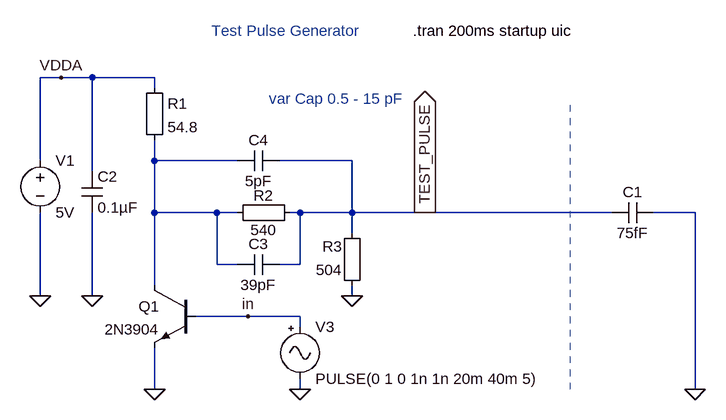
[diagram p0: schematic test_puls_generator.asc]
test_puls_generator.asc, the LTspice schematic file:
Version 4
SHEET 1 880 680
WIRE -144 0 -176 0
WIRE -96 0 -144 0
WIRE 0 0 -96 0
WIRE 0 16 0 0
WIRE -176 128 -176 0
WIRE 0 128 0 96
WIRE 128 128 0 128
WIRE 304 128 192 128
WIRE -96 144 -96 0
WIRE 0 208 0 128
WIRE 96 208 0 208
WIRE 128 208 96 208
WIRE 224 208 208 208
WIRE 304 208 304 128
WIRE 304 208 224 208
WIRE 416 208 304 208
WIRE 704 208 416 208
WIRE 832 208 768 208
WIRE 304 240 304 208
WIRE 96 288 96 208
WIRE 128 288 96 288
WIRE 224 288 224 208
WIRE 224 288 192 288
WIRE 0 320 0 208
WIRE -176 336 -176 208
WIRE -96 336 -96 208
WIRE 304 336 304 320
WIRE 144 368 64 368
WIRE 224 368 144 368
WIRE 224 384 224 368
WIRE 0 480 0 416
WIRE 224 480 224 464
WIRE 832 480 832 208
FLAG -176 336 0
FLAG -96 336 0
FLAG -144 0 VDDA
FLAG 416 208 TEST_PULSE
IOPIN 416 208 Out
FLAG 304 336 0
FLAG 0 480 0
FLAG 224 480 0
FLAG 144 368 in
FLAG 832 480 0
SYMBOL voltage -176 112 R0
WINDOW 123 0 0 Left 0
WINDOW 39 0 0 Left 0
SYMATTR InstName V1
SYMATTR Value 5V
SYMBOL Misc\\EuropeanResistor -16 0 R0
SYMATTR InstName R1
SYMATTR Value 54.8
SYMBOL Misc\\EuropeanResistor 224 192 R90
WINDOW 0 5 56 VBottom 0
WINDOW 3 27 56 VTop 0
SYMATTR InstName R2
SYMATTR Value 540
SYMBOL Misc\\EuropeanResistor 320 336 R180
WINDOW 0 31 76 Left 0
WINDOW 3 31 40 Left 0
SYMATTR InstName R3
SYMATTR Value 504
SYMBOL Misc\\EuropeanCap -112 144 R0
SYMATTR InstName C2
SYMATTR Value 0.1µF
SYMBOL Misc\\EuropeanCap 192 272 R90
WINDOW 0 0 32 VBottom 0
WINDOW 3 32 32 VTop 0
SYMATTR InstName C3
SYMATTR Value 39pF
SYMBOL Misc\\EuropeanCap 128 144 R270
WINDOW 0 32 32 VTop 0
WINDOW 3 0 32 VBottom 0
SYMATTR InstName C4
SYMATTR Value 5pF
SYMBOL npn 64 320 M0
SYMATTR InstName Q1
SYMATTR Value 2N3904
SYMBOL Misc\\signal 224 368 R0
WINDOW 123 0 0 Left 0
SYMATTR InstName V3
SYMATTR Value PULSE(0 1 0 1n 1n 20m 40m 5)
SYMATTR SpiceLine Rser=10
SYMBOL Misc\\EuropeanCap 768 192 R90
WINDOW 0 0 32 VBottom 0
WINDOW 3 32 32 VTop 0
SYMATTR InstName C1
SYMATTR Value 75fF
TEXT 88 -72 Left 0 ;Test Pulse Generator
TEXT 176 32 Left 0 ;var Cap 0.5 - 15 pF
TEXT 398 -72 Left 0 !.tran 200ms startup uic
LINE Normal 640 480 640 32 2

The netlist it stands for:
* test_puls_generator.asc
V1 VDDA 0 5V
R1 VDDA N001 54.8
R2 TEST_PULSE N001 540
R3 0 TEST_PULSE 504
C2 VDDA 0 0.1µF
C3 TEST_PULSE N001 39pF
C4 N001 TEST_PULSE 5pF
Q1 N001 in 0 0 2N3904
V3 in 0 PULSE(0 1 0 1n 1n 20m 40m 5) Rser=10
C1 0 TEST_PULSE 75fF
.model NPN NPN
.model PNP PNP
.lib standard.bjt
* Test Pulse Generator
* var Cap 0.5 - 15 pF
.tran 200ms startup uic
.backanno
.end